# Altium schematic sheet pca20054_sheet5_connectors.SchDoc: PCA20054 - Connectors
size A3; Organization: Nordic Semiconductor; DocumentNumber: 1; Revision: 1.0.0; SheetNumber: 5; SheetTotal: 5; Date: 2020-02-07; CompanyName: Nordic Semiconductor; DrawnBy: KJP; ProjectNumber: 4467
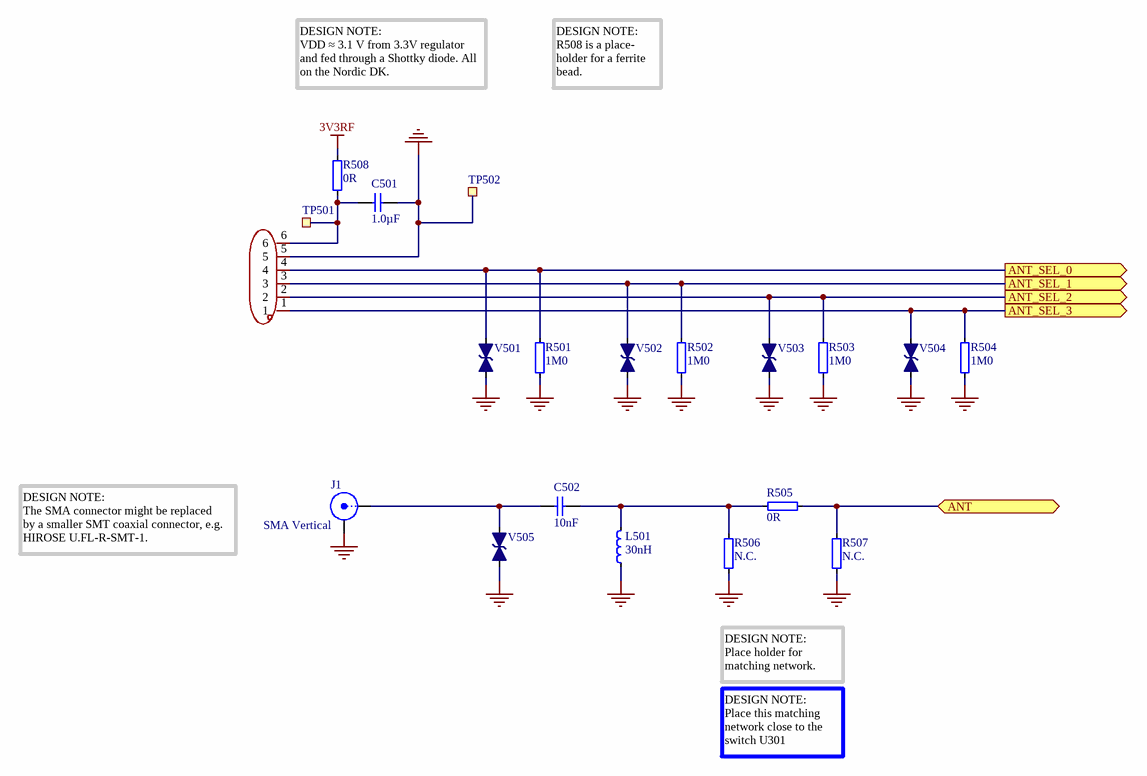
[diagram p0: pca20054_sheet5_connectors.SchDoc]

## Parts
C501  1.0µF  [CAPC1608X06L]
C502  10nF  [CAPC1005X04L]
J1  SMA Vertical  [CON_SMA_COAX_FEM_STRAIGHT_5P_1]
L501  30nH  [INDC1005X04L_WW]
R501  1M0  [RESC1005X04L]
R502  1M0  [RESC1005X04L]
R503  1M0  [RESC1005X04L]
R504  1M0  [RESC1005X04L]
R505  0R  [RESC1005X04L]
R506  N.C.  [RESC1005X04L_NC]
R507  N.C.  [RESC1005X04L_NC]
R508  0R  [RESC1005X04L]
TP501  Ø1.0mm,SMD  [TP_SMD_?.0mm]  (value not drawn)  (no BOM)
TP502  Ø1.0mm,SMD  [TP_SMD_?.0mm]  (value not drawn)  (no BOM)
U??  ZX-XH2.54-6PZZ  [CONN-TH_6P-P2.50_ZX-XH2.54-6PZZ]  (value not drawn)
V501  LXES15AAA1-133  [RESC1005X04L]  (value not drawn)
V502  LXES15AAA1-133  [RESC1005X04L]  (value not drawn)
V503  LXES15AAA1-133  [RESC1005X04L]  (value not drawn)
V504  LXES15AAA1-133  [RESC1005X04L]  (value not drawn)
V505  LXES15AAA1-133  [RESC1005X04L]  (value not drawn)

## Ports
ANT (bidir), ANT_SEL_0 (out), ANT_SEL_1 (out), ANT_SEL_2 (out), ANT_SEL_3 (out)

## Nets
3V3RF: R508.2
GND: C501.1 J1.2(Y) L501.1 R501.1 R502.1 R503.1 R504.1 R506.1 R507.1 TP502.1 U??.5 V501.2 V502.2 V503.2 V504.2 V505.2
ANT: R505.2 R507.2 ; port ANT
ANT_SEL_0: R501.2 U??.4 V501.1 ; port ANT_SEL_0
ANT_SEL_1: R502.2 U??.3 V502.1 ; port ANT_SEL_1
ANT_SEL_2: R503.2 U??.2 V503.1 ; port ANT_SEL_2
ANT_SEL_3: R504.2 U??.1 V504.1 ; port ANT_SEL_3
NetC501_2: C501.2 R508.1 TP501.1 U??.6
NetC502_1: C502.1 L501.2 R505.1 R506.2
NetC502_2: C502.2 J1.1(X) V505.1

## Notes on the sheet
- DESIGN NOTE:
  VDD ≈ 3.1 V from 3.3V regulator and fed through a Shottky diode. All on the Nordic DK.
- DESIGN NOTE:
  R508 is a place-
  holder for a ferrite bead.
- DESIGN NOTE:
  The SMA connector might be replaced
  by a smaller SMT coaxial connector, e.g.
  HIROSE U.FL-R-SMT-1.
- DESIGN NOTE:
  Place holder for matching network.
- DESIGN NOTE:
  Place this matching network close to the switch U301
- Size
- Date:
- A3
- Project Number
- Sheet         of
- Revision
- File:
- Drawn By:

## Library data of the parts
C501 = C0603-1µ0: Capacitor, X7R, ±10%; Part number IPS: 00000000616; Note: 16V; Artikkelnr Noca: 20039282; Part Number: C0603-1µ0; Manufacturer: *; Manufacturer Part Number: *; ComponentLink1URL: *; ComponentLink1Description: Datasheet; ComponentLink2URL: *; ComponentLink2Description: Supplier link; HelpURL: *; Footprint Doc: 0603; LatestRevisionDate: 2013-06-05; Pin Count: 2; Publisher: Nordic Semiconductor; Published: 2009-05-08; Value: 1.0µF; Supplier 1: *; Supplier Part Number 1: *; Supplier 2: *; Supplier Part Number 2: *
C502 = C0402-10n: Capacitor, X7R, ±10%; Part number IPS: 00000007784; Note: 16V; Artikkelnr Noca: 20039166; Part Number: C0402-10n; Manufacturer: *; Manufacturer Part Number: *; ComponentLink1URL: *; ComponentLink1Description: Datasheet; ComponentLink2URL: *; ComponentLink2Description: Supplier link; HelpURL: *; Footprint Doc: 0402; LatestRevisionDate: 2009-11-23; Pin Count: 2; Publisher: Nordic Semiconductor; Published: 2009-05-08; Value: 10nF; Supplier 1: *; Supplier Part Number 1: *; Supplier 2: *; Supplier Part Number 2: *
J1 = SMA-Vert-Std_Sigma: SMA Vertical connector; Artikkelnr Noca: N.A.; Part Number: SMA-Vert-Std_Sigma; Manufacturer: *; Manufacturer Part Number: *; ComponentLink1URL: *; ComponentLink1Description: Datasheet; ComponentLink2URL: *; ComponentLink2Description: Supplier link; HelpURL: *; Footprint Doc: SMA-VERT; LatestRevisionDate: 2009-12-12; Pin Count: 5; Publisher: Nordic Semiconductor; Published: 2009-12-12; Value: SMA Vertical; Note: SMA vertical; Supplier 1: *; Supplier Part Number 1: *; Supplier 2: *; Supplier Part Number 2: *; Part number IPS: N.A.
L501 = L0402-30n-Wirewound-Murata: Inductor, 270mA, ±2%, 580mΩ, Q=25; Manufacturer: Murata; Manufacturer Part Number: LQW15AN30NG00; Note: -55°C ~ 125°C; Artikkelnr Noca: N.A.; Part Number: L0402-30n-Wirewound-Murata; ComponentLink1URL: https://search.murata.co.jp/Ceramy/image/img/P02/JELF243A-0050.pdf; ComponentLink1Description: Datasheet; ComponentLink2URL: *; ComponentLink2Description: Supplier link; HelpURL: https://psearch.en.murata.com/inductor/product/LQW15AN30NG00%23.html; Footprint Doc: 0402; LatestRevisionDate: 2019-04-16; Pin Count: 2; Publisher: Nordic Semiconductor; Published: 2019-04-16; Value: 30nH; Supplier 1: Digi-Key; Supplier Part Number 1: 490-6802-1-ND; Supplier 2: *; Supplier Part Number 2: *; Part number IPS: N.A.
R501-R504 = R0402-1M0: Resistor, ±1%, 0.063W; Part number IPS: 00000006807; Note: Chip Res 1%; Artikkelnr Noca: 27049145; Part Number: R0402-1M0; Manufacturer: *; Manufacturer Part Number: *; ComponentLink1URL: *; ComponentLink1Description: Datasheet; ComponentLink2URL: *; ComponentLink2Description: Supplier link; HelpURL: *; Footprint Doc: 0402; LatestRevisionDate: 2009-11-23; Pin Count: 2; Publisher: Nordic Semiconductor; Published: 2009-05-08; Value: 1M0; Supplier 1: *; Supplier Part Number 1: *; Supplier 2: *; Supplier Part Number 2: *
R505 R508 = R0402-0R: Resistor, ±5%, 0.063W; Part number IPS: 00000007128; Note: Chip Res 5%; Artikkelnr Noca: 27049000; Part Number: R0402-0R; Manufacturer: *; Manufacturer Part Number: *; ComponentLink1URL: *; ComponentLink1Description: Datasheet; ComponentLink2URL: *; ComponentLink2Description: Supplier link; HelpURL: *; Footprint Doc: 0402; LatestRevisionDate: 2009-11-23; Pin Count: 2; Publisher: Nordic Semiconductor; Published: 2009-05-08; Value: 0R; Supplier 1: Farnell; Supplier Part Number 1: 146-9661; Supplier 2: *; Supplier Part Number 2: *
R506 R507 = R0402-N.C.: Not mounted; Assembly: Not mounted; Note: Chip Res; Artikkelnr Noca: N.A.; Part Number: R0402-N.C.; Manufacturer: *; Manufacturer Part Number: *; ComponentLink1URL: *; ComponentLink1Description: Datasheet; ComponentLink2URL: *; ComponentLink2Description: Supplier link; HelpURL: *; Footprint Doc: 0402; LatestRevisionDate: 2009-05-08; Pin Count: 2; Publisher: Nordic Semiconductor; Published: 2009-05-08; Value: N.C.; Supplier 1: *; Supplier Part Number 1: *; Supplier 2: *; Supplier Part Number 2: *; Part number IPS: N.A.
TP501 TP502 = TP_SMD_Ø1.0MM: 1.0mm circular SMD testpad; Manufacturer: Nordic Semiconductor; Artikkelnr Noca: N.A.; Part Number: TP_SMD_Ø1.0MM; Manufacturer Part Number: *; ComponentLink1URL: *; ComponentLink1Description: Datasheet; ComponentLink2URL: *; ComponentLink2Description: Supplier link; HelpURL: *; Footprint Doc: TP_SMD_Ø1.0mm; LatestRevisionDate: 2013-06-11; Pin Count: 1; Publisher: Nordic Semiconductor; Published: 2013-06-11; Value: Ø1.0mm,SMD; Note: *; Supplier 1: *; Supplier Part Number 1: *; Supplier 2: *; Supplier Part Number 2: *; Part number IPS: N.A.
U?? = ZX-XH2.54-6PZZ: Manufacturer: Megastar(兆星); Add into BOM: yes; Pins Structure: 1x6P; Pitch: 2.5mm; Reference Series: XH; Number of PINs Per Row: 6; Rated Current: 3A; Rated Voltage (Max): 250V; Plastic Material: PA66; Flame Retardant Rating: UL94V-0; Z-Height of the Board: 7mm; X-Length of Bottom Edge on Board (Spacing Line): 17.5mm; Y-Width of Bottom Edge on Board: 5.9mm; Symbol: ZX-XH2.54-6PZZ; Device: ZX-XH2.54-6PZZ; LCSC Part Name: 1x6P 间距:2.5mm 直插 系列:XH; Supplier Part: C7429636; Manufacturer Part: ZX-XH2.54-6PZZ; Supplier Footprint: 插件,P=2.5mm; JLCPCB Part Class: Extended Part; Datasheet: https://atta.szlcsc.com/upload/public/pdf/source/20230619/1243AD0A516E39CD3D274D8985780568.pdf; Supplier: LCSC; Convert to PCB: yes; Mounting Type: 直插; Number of Pins: 6P; Number of Rows: 1; Row Spacing: -; Contact Material: 黄铜; Contact Plating: 锡; Operating Temperature: -25℃~+85℃; Supplementary Features: -; Color: 白色
V501-V505 = LXES15AAA1-133: TVS DIODE 15VWM 0402; Manufacturer: Murata; Artikkelnr Noca: N.A.; Part Number: LXES15AAA1-133; Manufacturer Part Number: LXES15AAA1-133; ComponentLink1URL: *; ComponentLink1Description: Datasheet; ComponentLink2URL: *; ComponentLink2Description: Supplier link; HelpURL: http://www.murata.com/en-us/products/productdata/8796832759838/CRESD-E.pdf; Footprint Doc: 0402; LatestRevisionDate: 2017-09-20; Pin Count: 2; Publisher: Nordic Semiconductor; Published: 2017-09-20; Value: LXES15AAA1-133; Note: *; Supplier 1: Digi-Key; Supplier Part Number 1: 490-13209-6-ND; Supplier 2: Mouser; Supplier Part Number 2: 81-LXES15AAA1-133; Part number IPS: N.A.